# EAGLE design shopbot2kflop (EAGLE 7.5.0)
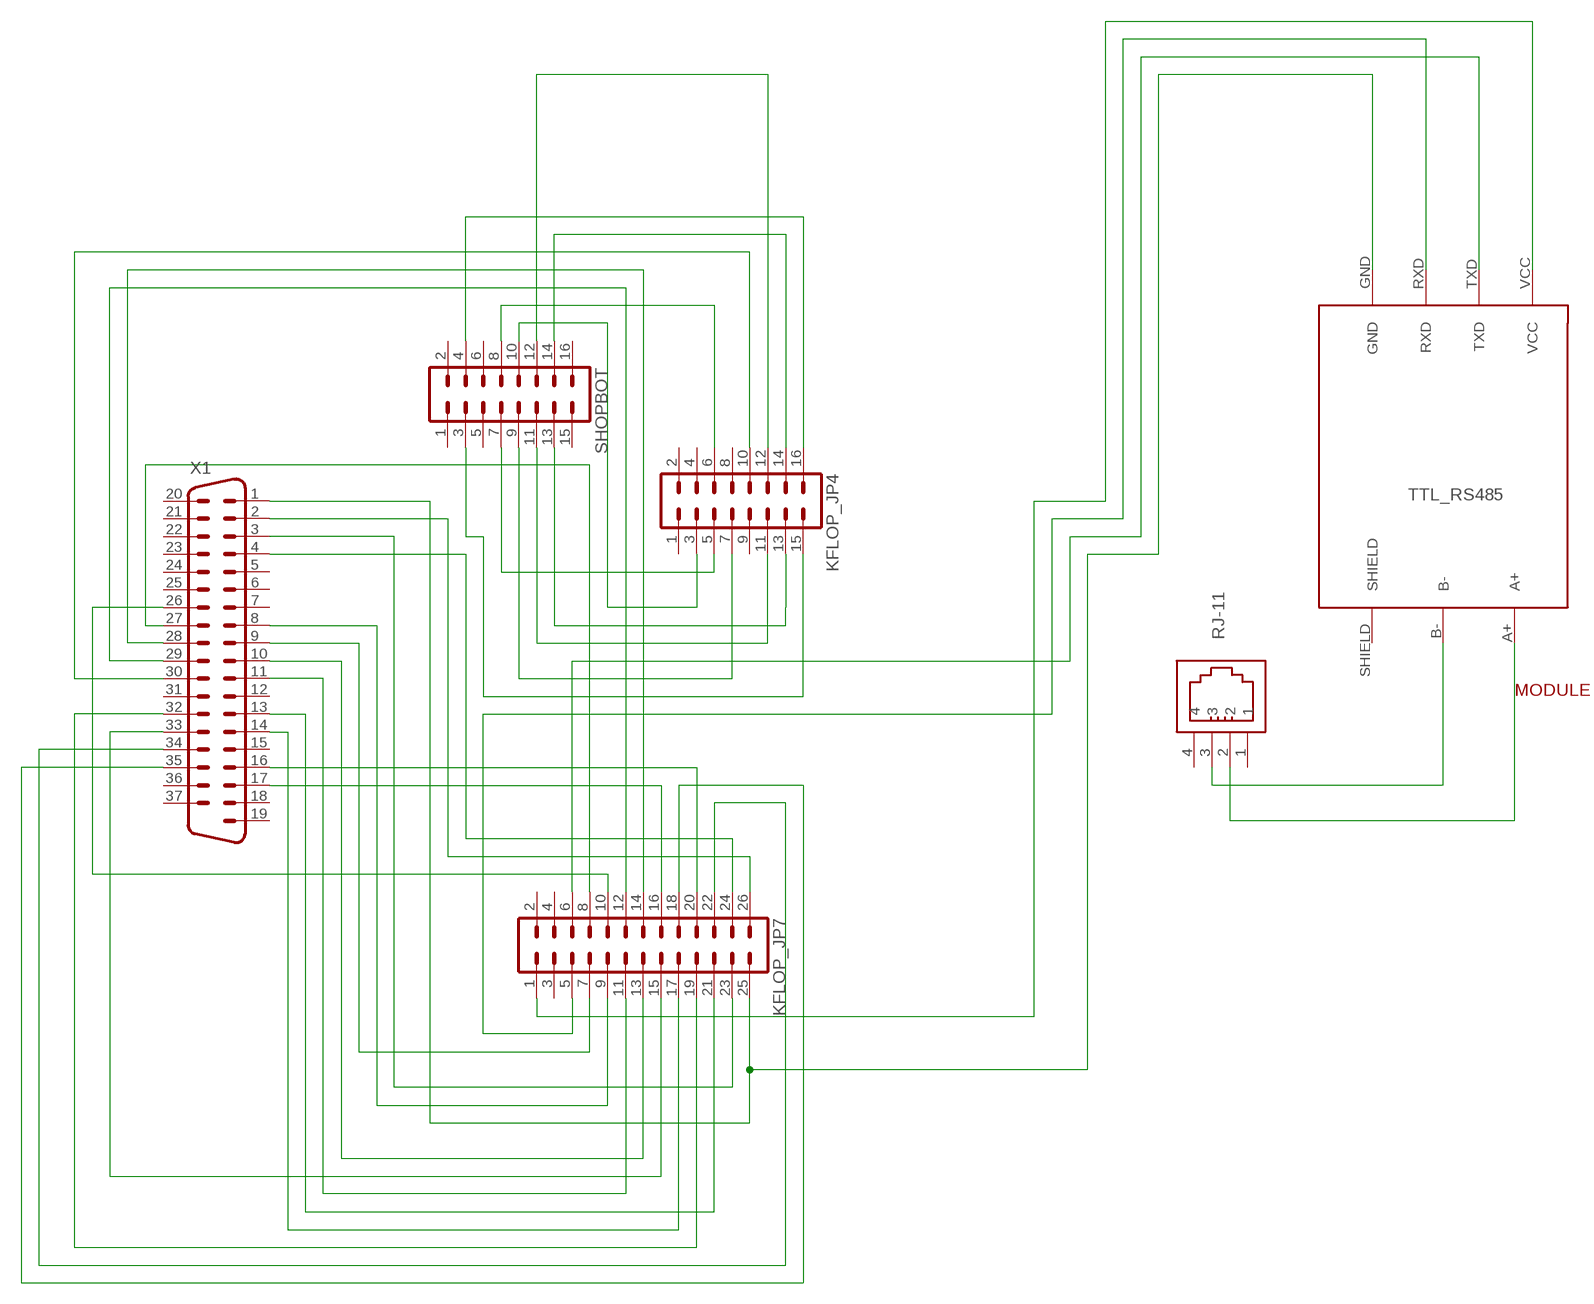
[diagram p0: schematic, sheet 1]

## Parts
KFLOP_JP4  MA08-2  [MA08-2]
KFLOP_JP7  MA13-2  [MA13-2]
MODULE  TTL_RS485  [TTL_RS485]
RJ-11  615004144121  [615004144121]
SHOPBOT  MA08-2  [MA08-2]
X1  M37HP  [M37HP]

## Nets
N$1: KFLOP_JP7.13 X1.10
N$2: KFLOP_JP4.6 SHOPBOT.8
N$3: KFLOP_JP7.18 X1.35
N$4: KFLOP_JP7.5 MODULE.RXD
N$5: KFLOP_JP7.26 X1.2
N$6: KFLOP_JP7.6 MODULE.TXD
N$7: KFLOP_JP4.5 SHOPBOT.7
N$8: KFLOP_JP4.3 SHOPBOT.10
N$9: KFLOP_JP4.15 SHOPBOT.3
N$10: KFLOP_JP4.16 SHOPBOT.4
N$11: KFLOP_JP4.7 SHOPBOT.9
N$12: MODULE.B- RJ-11.3
N$13: KFLOP_JP7.23 X1.3
N$14: KFLOP_JP7.24 X1.4
N$15: KFLOP_JP7.9 X1.8
N$16: KFLOP_JP7.7 X1.9
N$17: KFLOP_JP7.1 MODULE.VCC
N$18: KFLOP_JP7.11 X1.11
N$19: KFLOP_JP7.21 X1.13
N$20: KFLOP_JP7.17 X1.14
N$21: KFLOP_JP7.20 X1.16
N$22: KFLOP_JP7.16 X1.17
N$23: KFLOP_JP7.10 X1.26
N$24: KFLOP_JP7.8 X1.27
N$25: KFLOP_JP7.14 X1.28
N$26: KFLOP_JP7.12 X1.29
N$27: KFLOP_JP4.10 X1.30
N$28: KFLOP_JP7.19 X1.32
N$29: KFLOP_JP7.15 X1.33
N$30: KFLOP_JP7.22 X1.34
N$31: KFLOP_JP4.11 SHOPBOT.11
N$32: KFLOP_JP7.25 MODULE.GND X1.1
N$33: MODULE.A+ RJ-11.2
N$34: KFLOP_JP4.12 SHOPBOT.12
N$35: KFLOP_JP4.13 SHOPBOT.13
N$36: KFLOP_JP4.14 SHOPBOT.14
Unconnected: KFLOP_JP4.1 KFLOP_JP4.2 KFLOP_JP4.4 KFLOP_JP4.8 KFLOP_JP4.9 KFLOP_JP7.2 KFLOP_JP7.3 KFLOP_JP7.4 MODULE.SHIELD RJ-11.1 RJ-11.4 SHOPBOT.1 SHOPBOT.2 SHOPBOT.5 SHOPBOT.6 SHOPBOT.15 SHOPBOT.16 X1.5 X1.6 X1.7 X1.12 X1.15 X1.18 X1.19 X1.20 X1.21 X1.22 X1.23 X1.24 X1.25 X1.31 X1.36 X1.37

## Library data of the parts
KFLOP_JP4 SHOPBOT = con-lstb:MA08-2: PIN HEADER; OC_FARNELL: unknown; OC_NEWARK: unknown
KFLOP_JP7 = con-lstb:MA13-2: PIN HEADER; OC_FARNELL: unknown; OC_NEWARK: unknown
MODULE = SMAKN:TTL_RS485
RJ-11 = Wurth_Elektronik_Electromechanic_Input-Output_Connectors_rev16a:615004144121: WR-MJ Vertical Plastic 6PxC Modular Jack With Ear,4 pins=>Code : Con_I-O_MJ-V_Plastic_615004144121 <http://katalog.we-online.de/media/images/eican/Con_I-O_MJ-V_Plastic_6150xx144121_pf2.jpg> Details see: http://katalog.we-online.de/en/em/615_0xx_144_121 Created 2014-07-10, Karrer Zheng 2014 (C) Würth Elektronik
X1 = con-subd:M37: SUB-D; OC_FARNELL: unknown; OC_NEWARK: unknown

## Board
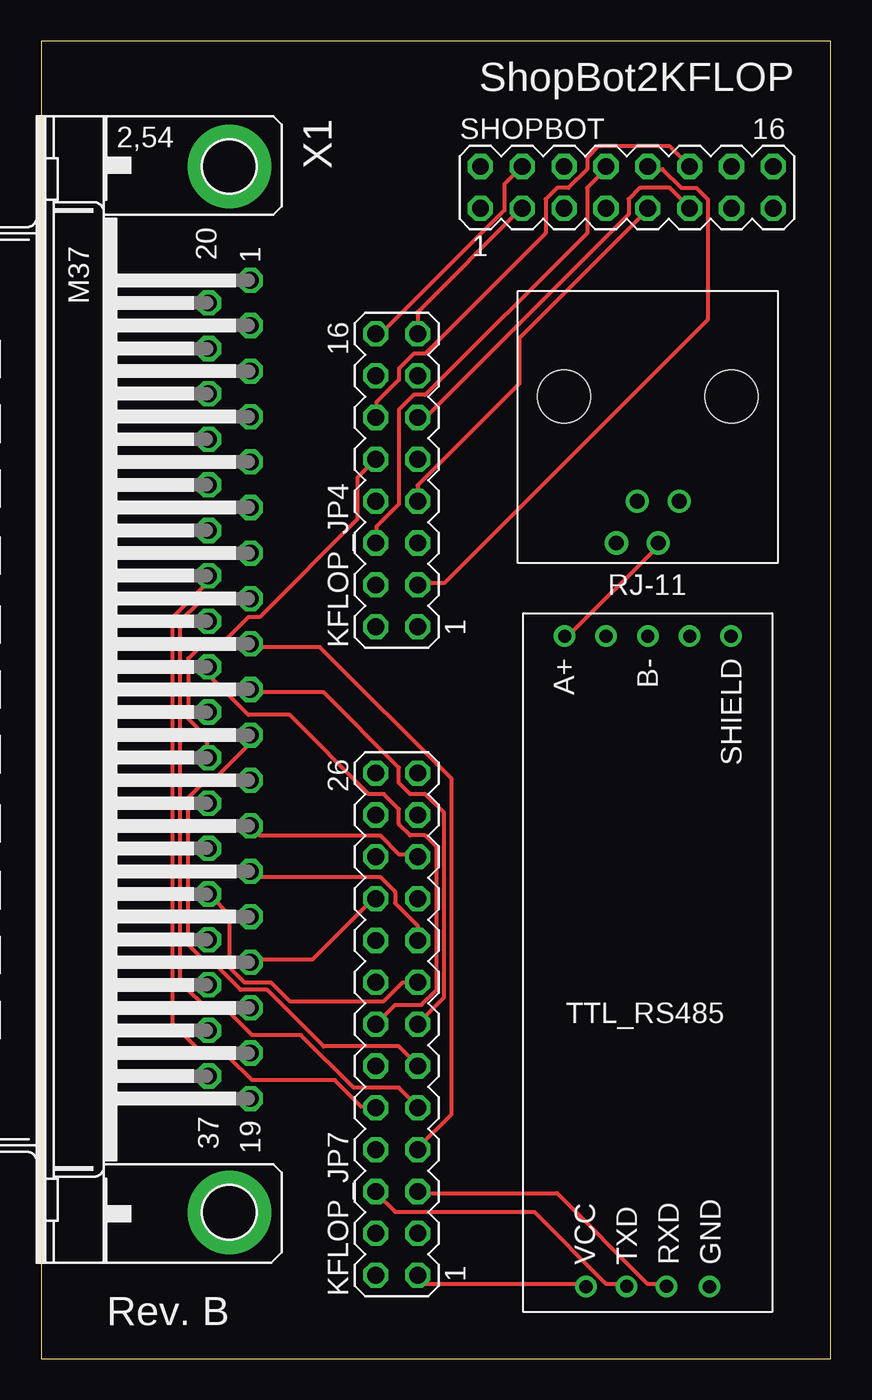
[diagram p1: board, top side]
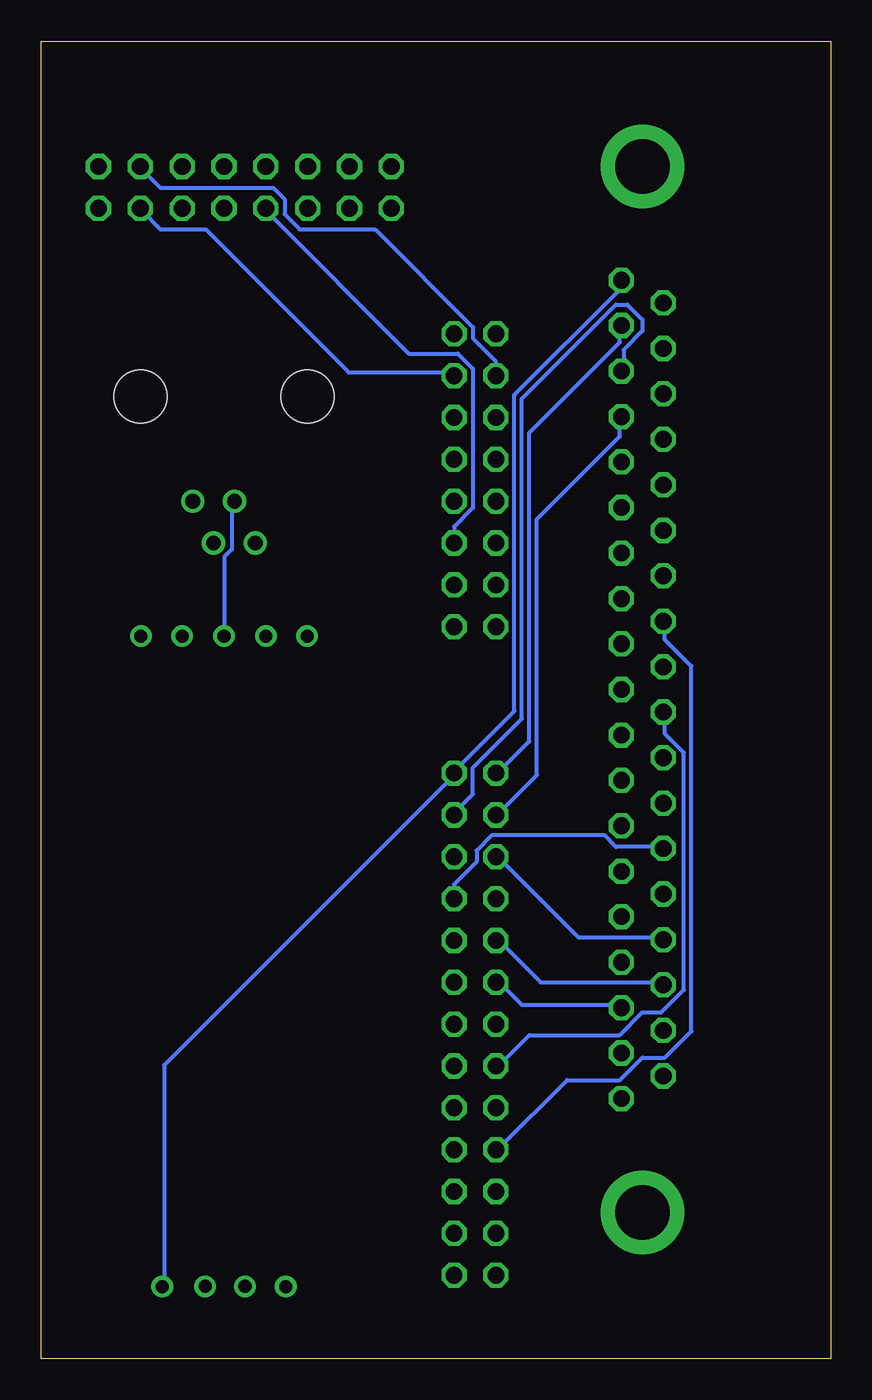
[diagram p2: board, bottom side, seen from below]

Size 47.93 x 80 mm. Coordinates in mm from the lower left corner, seen from the top.
Outline: 0,0 47.93,0 47.93,80 0,80 0,0
Copper layers (1*16): Top 0.035mm / dielectric 1.5mm / Bottom 0.035mm
Design rules "default": minimum track width 10mil, minimum drill 24mil, track to track 8mil, track to pad 8mil, pad to pad 8mil, via to via 8mil, smd to smd 8mil, copper to edge 40mil, drill to drill 8mil, minimum pad ring 10mil, minimum via ring 8mil, stop-mask expansion 4mil, vias tented up to drill 0mil, thermal gap 10mil

### Footprints (pad centres in the part's own frame; a part is rotated, then mirrored left to right if it is on the bottom)
MA08-2 = drill 1.016 octagon: 1 -8.89,-1.27; 2 -8.89,1.27; 3 -6.35,-1.27; 4 -6.35,1.27; 5 -3.81,-1.27; 6 -3.81,1.27; 7 -1.27,-1.27; 8 -1.27,1.27; 9 1.27,-1.27; 10 1.27,1.27; 11 3.81,-1.27; 12 3.81,1.27; 13 6.35,-1.27; 14 6.35,1.27; 15 8.89,-1.27; 16 8.89,1.27
MA13-2 = drill 1.016 octagon: 1 -15.24,-1.27; 2 -15.24,1.27; 3 -12.7,-1.27; 4 -12.7,1.27; 5 -10.16,-1.27; 6 -10.16,1.27; 7 -7.62,-1.27; 8 -7.62,1.27; 9 -5.08,-1.27; 10 -5.08,1.27; 11 -2.54,-1.27; 12 -2.54,1.27; 13 0,-1.27; 14 0,1.27; 15 2.54,-1.27; 16 2.54,1.27; 17 5.08,-1.27; 18 5.08,1.27; 19 7.62,-1.27; 20 7.62,1.27; 21 10.16,-1.27; 22 10.16,1.27; 23 12.7,-1.27; 24 12.7,1.27; 25 15.24,-1.27; 26 15.24,1.27
TTL_RS485 = drill 0.8: A+ 5.05,-19.75; B- 0,-19.75; GND -3.75,19.75; P$1 -2.54,-19.75; P$2 2.54,-19.75; RXD -1.14,19.73; SHIELD -5.05,-19.75; TXD 1.28,19.73; VCC 3.75,19.75
615004144121 = drill 0.9: 1 -1.905,-1.27; 2 -0.635,1.27; 3 0.635,-1.27; 4 1.905,1.27 | hole 3.2: -5.08,-7.62; 5.08,-7.62
M37HP = drill 1.016 octagon: 1 -24.841,1.27; 2 -22.098,1.27; 3 -19.329,1.27; 4 -16.561,1.27; 5 -13.818,1.27; 6 -11.049,1.27; 7 -8.28,1.27; 8 -5.512,1.27; 9 -2.769,1.27; 10 0,1.27; 11 2.769,1.27; 12 5.512,1.27; 13 8.28,1.27; 14 11.049,1.27; 15 13.792,1.27; 16 16.561,1.27; 17 19.329,1.27; 18 22.073,1.27; 19 24.841,1.27; 20 -23.47,-1.27; 21 -20.701,-1.27; 22 -17.958,-1.27; 23 -15.189,-1.27; 24 -12.421,-1.27; 25 -9.652,-1.27; 26 -6.909,-1.27; 27 -4.14,-1.27; 28 -1.372,-1.27; 29 1.372,-1.27; 30 4.14,-1.27; 31 6.909,-1.27; 32 9.652,-1.27; 33 12.421,-1.27; 34 15.189,-1.27; 35 17.932,-1.27; 36 20.701,-1.27; 37 23.47,-1.27 | drill 3.302 pad 5.08: G1 -31.75,0; G2 31.75,0

### Placement (x,y rotation side)
KFLOP_JP4  21.59,53.34 90 top
KFLOP_JP7  21.59,20.32 90 top
MODULE  36.83,24.13 180 top
RJ-11  36.83,50.8 180 top
SHOPBOT  35.56,71.12 0 top
X1  11.43,40.64 270 top

### Tracks (layer width: path | path; a pad name or v marks a point on that pad's centre or on a via)
N$1
  Top 0.254: X1.10 12.8,40.46 17.14,40.46 21.72,35.89 21.72,34.98 22.4,34.29 23.32,34.29 24.46,33.15 24.46,21.95 22.86,20.34 KFLOP_JP7.13
N$2
  Top 0.254: KFLOP_JP4.6 20.34,49.61 20.34,50.52 21.72,51.89 21.72,57.61 22.63,58.52 23.32,58.52 33.15,68.35 33.15,71.09 34.29,72.24 SHOPBOT.8
N$3
  Bottom 0.254: X1.35 10.29,22.86 17.6,22.86 20.12,25.38 KFLOP_JP7.18
N$4
  Top 0.254: MODULE.RXD 37.95,4.57 36.8,4.57 31.32,10.06 22.86,10.06 KFLOP_JP7.5
N$5
  Bottom 0.254: X1.2 12.8,62.64 12.8,61.72 18.29,56.24 18.29,37.49 20.12,35.66 KFLOP_JP7.26
N$6
  Top 0.254: MODULE.TXD 35.43,4.57 34.29,4.57 29.95,8.91 21.49,8.91 20.34,10.06 KFLOP_JP7.6
N$7
  Bottom 0.254: KFLOP_JP4.5 22.86,50.52 21.72,51.66 21.72,60.12 22.63,61.04 25.6,61.04 34.29,69.72 SHOPBOT.7
N$8
  Top 0.254: KFLOP_JP4.3 22.86,47.09 24.46,47.09 40.46,63.09 40.46,70.41 39.78,71.09 38.86,71.09 37.72,72.24 37.03,72.24 SHOPBOT.10
N$9
  Top 0.254: KFLOP_JP4.15 22.86,63.55 29.03,69.72 SHOPBOT.3
N$10
  Top 0.254: KFLOP_JP4.16 20.34,62.41 20.8,62.41 28.12,69.72 28.12,71.32 29.03,72.24 SHOPBOT.4
N$11
  Top 0.254: KFLOP_JP4.7 22.86,53.03 29.03,59.21 29.03,61.95 36.8,69.72 SHOPBOT.9
N$12
  Bottom 0.254: MODULE.B- 36.8,43.89 36.8,48.69 36.35,49.15 36.35,51.89 RJ-11.3
N$13
  Bottom 0.254: X1.3 12.57,60.12 12.57,61.27 11.43,62.41 11.43,63.09 12.34,64.01 13.03,64.01 18.75,58.29 18.75,38.86 21.72,35.89 21.72,34.29 22.86,33.15 KFLOP_JP7.23
N$14
  Bottom 0.254: X1.4 12.8,57.15 12.8,56.01 17.83,50.98 17.83,35.43 20.12,33.15 KFLOP_JP7.24
N$15
  Top 0.254: X1.8 12.57,45.95 9.6,45.95 8.46,44.81 8.46,22.86 10.29,21.03 11.43,21.03 12.8,19.66 15.77,19.66 18.97,16.46 21.72,16.46 22.86,15.32 KFLOP_JP7.9
N$16
  Top 0.254: X1.9 12.8,43.2 16.92,43.2 24.92,35.2 24.92,14.86 22.86,12.8 KFLOP_JP7.7
N$17
  Top 0.254: MODULE.VCC 32.92,4.57 23.32,4.57 22.86,5.03 KFLOP_JP7.1
N$18
  Top 0.254: X1.11 12.57,37.72 12.57,37.26 10.29,34.98 9.83,34.98 8.91,34.06 8.91,25.15 10.06,24 10.52,24 12.12,22.4 13.72,22.4 17.14,18.97 21.72,18.97 22.86,17.83 KFLOP_JP7.11
N$19
  Top 0.254: KFLOP_JP7.21 22.86,30.63 21.72,30.63 20.57,31.77 13.26,31.77 12.8,32.23 X1.13
N$20
  Top 0.254: KFLOP_JP7.17 22.86,26.29 21.49,27.66 21.49,28.35 20.57,29.26 13.03,29.26 X1.14
N$21
  Top 0.254: X1.16 12.8,24.23 16.46,24.23 20.12,27.89 KFLOP_JP7.20
N$22
  Bottom 0.254: X1.17 12.8,21.49 18.75,21.49 20.12,22.86 KFLOP_JP7.16
N$23
  Top 0.254: X1.26 10.06,47.55 10.06,47.09 8,45.03 8,20.34 10.06,18.29 11.43,18.29 12.8,16.92 17.83,16.92 19.43,15.32 20.12,15.32 KFLOP_JP7.10
N$24
  Bottom 0.254: X1.27 10.06,44.58 10.06,43.66 8.46,42.06 8.46,19.89 10.06,18.29 11.43,18.29 12.8,16.92 16,16.92 20.12,12.8 KFLOP_JP7.8
N$25
  Top 0.254: KFLOP_JP7.14 21.49,21.49 23.09,21.49 24,22.4 24,31.09 23.32,31.77 22.4,31.77 21.72,32.46 21.72,33.38 20.8,34.29 19.89,34.29 15.09,39.09 12.57,39.09 10.29,41.38 10.29,41.83 X1.28
N$26
  Bottom 0.254: X1.29 10.06,39.09 10.06,37.95 8.91,36.8 8.91,22.4 10.29,21.03 11.43,21.03 12.8,19.66 18.29,19.66 20.12,17.83 KFLOP_JP7.12
N$27
  Top 0.254: KFLOP_JP4.10 19.2,53.49 19.2,50.98 13.26,45.03 12.57,45.03 11.2,43.66 10.06,43.66 8.91,42.52 8.91,38.86 10.06,37.72 10.06,36.58 X1.30
N$28
  Bottom 0.254: KFLOP_JP7.19 22.86,28.8 21.49,30.18 21.49,30.86 20.57,31.77 13.72,31.77 13.03,31.09 10.29,31.09 X1.32
N$29
  Top 0.254: KFLOP_JP7.15 21.95,22.86 20.8,21.72 15.09,21.72 13.95,22.86 12.34,22.86 11.43,23.77 11.43,26.98 10.29,28.12 X1.33
N$30
  Bottom 0.254: X1.34 10.29,25.6 15.32,25.6 20.12,30.4 KFLOP_JP7.22
N$31
  Top 0.254: KFLOP_JP4.11 23.32,57.15 35.66,69.49 35.66,70.41 36.35,71.09 38.18,71.09 39.32,69.95 SHOPBOT.11
N$32
  Bottom 0.254: MODULE.GND 40.46,4.57 40.46,17.83 22.86,35.43 KFLOP_JP7.25 22.86,35.66 19.2,39.32 19.2,58.52 12.8,64.92 12.8,65.38 X1.1
N$33
  Top 0.254: MODULE.A+ 32,43.89 37.49,49.38 RJ-11.2
N$34
  Top 0.254: KFLOP_JP4.12 20.34,57.15 20.34,58.06 21.72,59.44 21.72,60.12 22.63,61.04 23.32,61.04 30.63,68.35 30.63,70.41 31.32,71.09 32,71.09 33.15,72.24 33.15,72.92 33.83,73.61 38.18,73.61 39.32,72.47 SHOPBOT.12
N$35
  Bottom 0.254: KFLOP_JP4.13 22.86,59.89 29.26,59.89 37.95,68.58 40.69,68.58 41.83,69.72 SHOPBOT.13
N$36
  Bottom 0.254: KFLOP_JP4.14 20.34,59.89 20.34,60.58 21.72,61.95 21.72,62.64 27.66,68.58 32.23,68.58 33.15,69.49 33.15,70.41 33.83,71.09 40.69,71.09 41.83,72.24 SHOPBOT.14

### Text on the board
tPlace: ShopBot2KFLOP | Rev. B